# EAGLE design spt_interface_v5_withbattcheck (EAGLE 7.5.0)
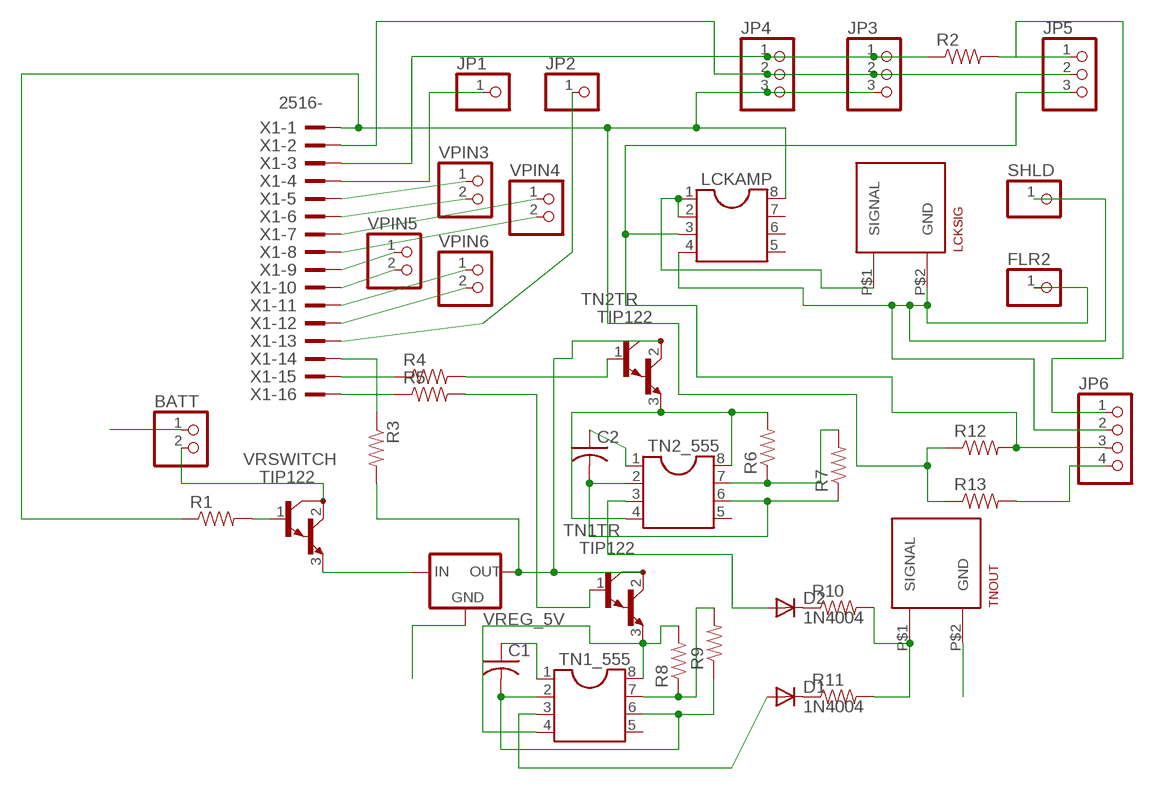
[diagram p0: schematic, sheet 1]

## Parts
BATT  PINHD-1X2  [1X02]
C1  C-US050-024X044  [C050-024X044]
C2  C-US050-024X044  [C050-024X044]
D1  1N4004  [DO41-10]
D2  1N4004  [DO41-10]
FLR2  PINHD-1X1  [1X01]
JP1  PINHD-1X1  [1X01]
JP2  PINHD-1X1  [1X01]
JP3  PINHD-1X3  [1X03]
JP4  PINHD-1X3  [1X03]
JP5  PINHD-1X3  [1X03]
JP6  PINHD-1X4  [1X04]
LCKAMP  DIL8  [DIL08]
LCKSIG  BNC_VERTICAL  [BNC_VERTICAL]
R1  1KOHM-1/4W-5%(PTH)HORIZ-KIT  [AXIAL-0.3EZ]
R2  1KOHM-1/4W-5%(PTH)HORIZ-KIT  [AXIAL-0.3EZ]
R3  1KOHM-1/4W-5%(PTH)HORIZ-KIT  [AXIAL-0.3EZ]
R4  1KOHM-1/4W-5%(PTH)HORIZ-KIT  [AXIAL-0.3EZ]
R5  1KOHM-1/4W-5%(PTH)HORIZ-KIT  [AXIAL-0.3EZ]
R6  1KOHM-1/4W-5%(PTH)HORIZ-KIT  [AXIAL-0.3EZ]
R7  1KOHM-1/4W-5%(PTH)HORIZ-KIT  [AXIAL-0.3EZ]
R8  1KOHM-1/4W-5%(PTH)HORIZ-KIT  [AXIAL-0.3EZ]
R9  1KOHM-1/4W-5%(PTH)HORIZ-KIT  [AXIAL-0.3EZ]
R10  1KOHM-1/4W-5%(PTH)HORIZ-KIT  [AXIAL-0.3EZ]
R11  1KOHM-1/4W-5%(PTH)HORIZ-KIT  [AXIAL-0.3EZ]
R12  1KOHM-1/4W-5%(PTH)HORIZ-KIT  [AXIAL-0.3EZ]
R13  1KOHM-1/4W-5%(PTH)HORIZ-KIT  [AXIAL-0.3EZ]
SHLD  PINHD-1X1  [1X01]
TN1_555  DIL8  [DIL08]
TN1TR  TIP122  [TO220]
TN2_555  DIL8  [DIL08]
TN2TR  TIP122  [TO220]
TNOUT  BNC_VERTICAL  [BNC_VERTICAL]
VPIN3  PINHD-1X2  [1X02]
VPIN4  PINHD-1X2  [1X02]
VPIN5  PINHD-1X2  [1X02]
VPIN6  PINHD-1X2  [1X02]
VREG_5V  78XXL  [78XXL]
VRSWITCH  TIP122  [TO220]
X1  2516-  [PAK100/2500-16]

## Nets
GND: BATT.1 C1.1 C2.1 FLR2.1 JP3.2 JP4.2 JP5.2 JP6.2 LCKAMP.4 LCKSIG.P$2(GND) SHLD.1 TN1_555.1 TN2_555.1 TNOUT.P$2(GND) VREG_5V.GND X1.2
N$1: R3.P$1 X1.14
N$2: BATT.2 VRSWITCH.2(C)
N$3: R4.P$2 TN2TR.1(B)
N$4: R5.P$2 TN1TR.1(B)
N$5: R8.P$2 TN1_555.4 TN1_555.8 TN1TR.3(E)
N$6: D2.C R10.P$1
N$7: R4.P$1 X1.15
N$8: JP3.3 JP4.3 LCKAMP.8 R1.P$1 R12.P$1 R13.P$1 X1.1
N$9: D1.A TN1_555.3
N$10: LCKAMP.1 LCKAMP.2 LCKSIG.P$1(SIGNAL)
N$11: R6.P$1 R7.P$2 TN2_555.7
N$12: R8.P$1 R9.P$2 TN1_555.7
N$13: C2.2 R7.P$1 TN2_555.2 TN2_555.6
N$14: C1.2 R9.P$1 TN1_555.2 TN1_555.6
N$15: D2.A TN2_555.3
N$16: VPIN5.1 X1.9
N$17: R10.P$2 R11.P$2 TNOUT.P$1(SIGNAL)
N$18: JP3.1 JP4.1 R2.P$1 X1.3
N$19: JP5.1 JP6.1 R2.P$2
N$20: VPIN3.1 X1.5
N$21: VPIN3.2 X1.6
N$22: VPIN4.1 X1.7
N$23: VPIN4.2 X1.8
N$24: VPIN5.2 X1.10
N$25: VPIN6.1 X1.11
N$26: VPIN6.2 X1.12
N$27: R6.P$2 TN2_555.4 TN2_555.8 TN2TR.3(E)
N$28: JP5.3 JP6.3 LCKAMP.3 R12.P$2
N$29: VREG_5V.IN VRSWITCH.3(E)
N$30: JP1.1 X1.4
N$31: JP2.1 X1.13
N$32: R1.P$2 VRSWITCH.1(B)
N$33: D1.C R11.P$1
N$34: R5.P$1 X1.16
N$35: R3.P$2 TN1TR.2(C) TN2TR.2(C) VREG_5V.OUT
N$36: JP6.4 R13.P$2
Unconnected: LCKAMP.5 LCKAMP.6 LCKAMP.7 TN1_555.5 TN2_555.5

## Library data of the parts
BATT VPIN3-VPIN6 = pinhead:PINHD-1X2: PIN HEADER
C1 C2 = rcl:C-US: CAPACITOR, American symbol
D1 D2 = diode:1N4004: DIODE general purpose rectifier, 1 A
FLR2 JP1 JP2 SHLD = pinhead:PINHD-1X1: PIN HEADER
JP3-JP5 = pinhead:PINHD-1X3: PIN HEADER
JP6 = pinhead:PINHD-1X4: PIN HEADER
LCKAMP TN1_555 TN2_555 = ic-package:DIL8: Dual In Line / Socket
LCKSIG TNOUT = open-ephys:BNC_VERTICAL: BNC plug, through-hole, vertical
R1-R13 = SparkFun-Resistors:1KOHM-1/4W-5%(PTH): RES-08380; PROD_ID: RES-08380; VALUE: 1k
TN1TR TN2TR VRSWITCH = transistor-npn:TIP122*: NPN Darlington Transistor
VREG_5V = v-reg:78XXL: VOLTAGE REGULATOR
X1 = con-3m:2516-: 3M (TM) Pak 100 4-Wall Header Source: 3M; OC_FARNELL: unknown; OC_NEWARK: unknown

## Board
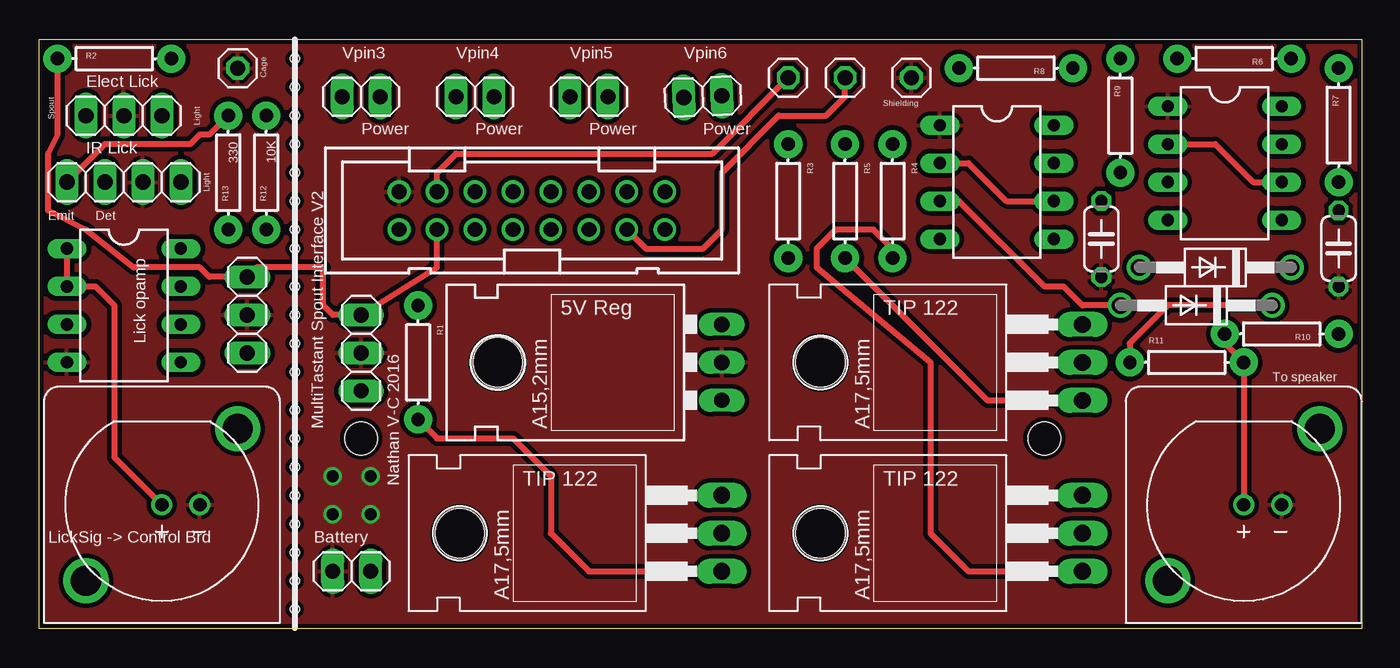
[diagram p1: board, top side]
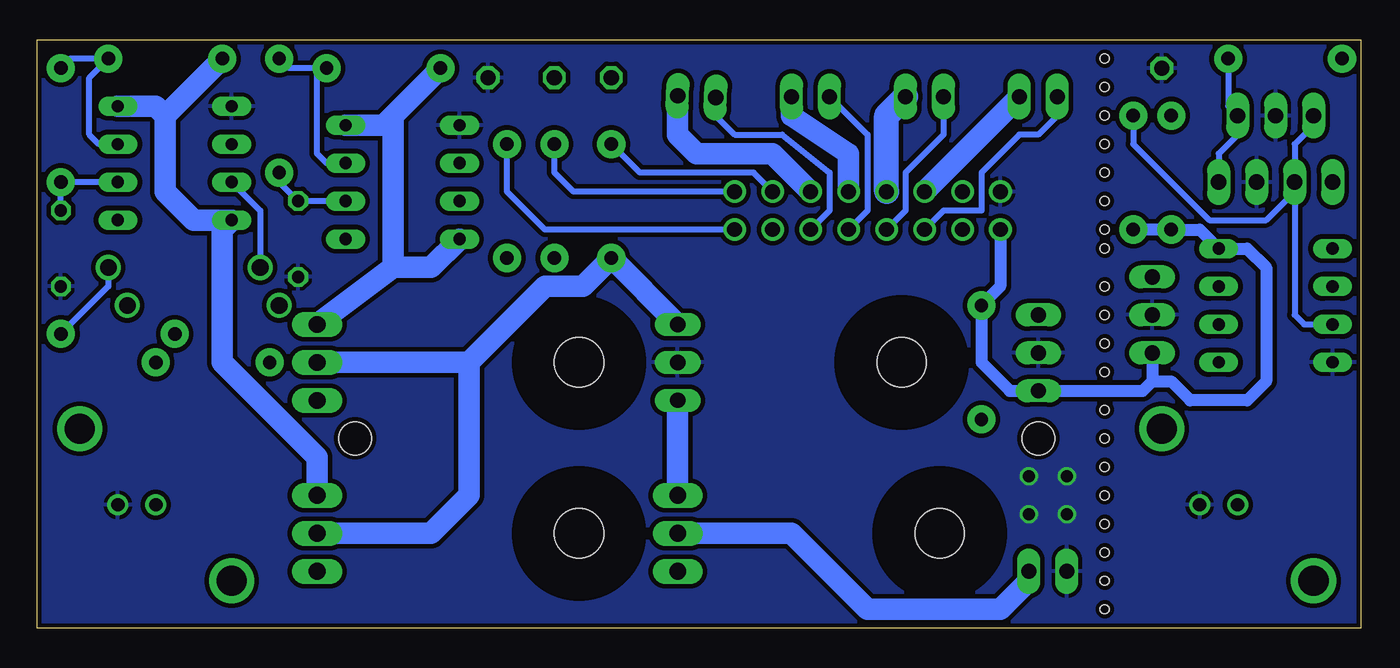
[diagram p2: board, bottom side, seen from below]

Size 88.57 x 39.36 mm. Coordinates in mm from the lower left corner, seen from the top.
Outline: 0,0 88.57,0 88.57,39.36 0,39.36 0,0
Copper layers (1*16): Top 0.035mm / dielectric 1.5mm / Bottom 0.035mm
Design rules "SeeedStudio_2layer_DRU_no_angle_20140221": minimum track width 6mil, minimum drill 12mil, track to track 6mil, track to pad 6mil, pad to pad 6mil, via to via 6mil, smd to smd 0mil, copper to edge 10mil, drill to drill 10mil, minimum pad ring 10mil, minimum via ring 6mil, stop-mask expansion 2mil, vias tented up to drill 100mil, thermal gap 10mil
Holes 2.2 mm at 21.59,12.7 67.31,12.7
Holes 0.6 mm at 17.14,38.1 17.14,36.2 17.14,34.29 17.14,32.38 17.14,28.57 17.14,26.67 17.14,25.4 17.14,22.86 17.14,20.95 17.14,19.05 17.14,17.14 17.14,14.61 17.14,30.48 17.14,12.7 17.14,10.79 17.14,8.89 17.14,6.99 17.14,5.08 17.14,3.17 17.14,1.27

### Footprints (pad centres in the part's own frame; a part is rotated, then mirrored left to right if it is on the bottom)
1X02 = drill 1.016 long: 1 -1.27,0; 2 1.27,0
C050-024X044 = drill 0.813 octagon: 1 -2.54,0; 2 2.54,0
DO41-10 = drill 1.118: A 5.08,0; C -5.08,0
1X01 = drill 1.016 octagon: 1 0,0
1X03 = drill 1.016 long: 1 -2.54,0; 2 0,0; 3 2.54,0
1X04 = drill 1.016 long: 1 -3.81,0; 2 -1.27,0; 3 1.27,0; 4 3.81,0
DIL08 = drill 0.813 long: 1 -3.81,-3.81; 2 -1.27,-3.81; 3 1.27,-3.81; 4 3.81,-3.81; 5 3.81,3.81; 6 1.27,3.81; 7 -1.27,3.81; 8 -3.81,3.81
BNC_VERTICAL = drill 0.89: P$1 0,0; P$2 2.54,0 | drill 2.01: P$3 5.08,5.08; P$4 -5.08,-5.08
AXIAL-0.3EZ = drill 0.9 pad 1.88: P$1 -3.81,0; P$2 3.81,0
TO220 = drill 1.118 long: 1 -2.54,-6.35; 2 0,-6.35; 3 2.54,-6.35 | hole 3.302: 0,11.176
78XXL = drill 1.016 long: GND 0,-3.81; IN -2.54,-3.81; OUT 2.54,-3.81 | hole 3.302: 0,11.176
PAK100/2500-16 = drill 1 pad 1.422: 1 -8.89,-1.27; 2 -8.89,1.27; 3 -6.35,-1.27; 4 -6.35,1.27; 5 -3.81,-1.27; 6 -3.81,1.27; 7 -1.27,-1.27; 8 -1.27,1.27; 9 1.27,-1.27; 10 1.27,1.27; 11 3.81,-1.27; 12 3.81,1.27; 13 6.35,-1.27; 14 6.35,1.27; 15 8.89,-1.27; 16 8.89,1.27

### Placement (x,y rotation side)
BATT  20.95,3.81 0 top
C1  71.12,26.04 90 top
C2  87,25.4 90 top
D1  77.47,21.59 180 top
D2  78.74,24.13 180 top
FLR2  13.34,37.47 0 top
JP1  50.16,36.83 0 top
JP2  53.98,36.83 0 top
JP3  13.97,20.95 270 top
JP4  21.59,18.41 270 top
JP5  5.71,34.29 180 top
JP6  5.71,29.84 180 top
LCKAMP  5.71,21.59 270 top
LCKSIG  8.26,8.26 0 top
R1  25.4,17.78 270 top
R2  5.08,38.1 0 top
R3  50.16,28.57 270 top
R4  57.15,28.57 270 top
R5  53.98,28.57 270 top
R6  80.01,38.1 180 top
R7  87,33.66 90 top
R8  65.41,37.47 180 top
R9  72.39,34.29 90 top
R10  83.19,19.68 180 top
R11  76.83,17.78 0 top
R12  15.24,30.48 90 top
R13  12.7,30.48 90 top
SHLD  58.42,36.83 0 top
TN1_555  64.14,29.84 270 top
TN1TR  63.5,17.78 90 top
TN2_555  79.38,31.11 270 top
TN2TR  63.5,6.35 90 top
TNOUT  80.64,8.26 0 top
VPIN3  21.59,35.56 0 top
VPIN4  29.21,35.56 0 top
VPIN5  36.83,35.56 0 top
VPIN6  44.45,35.56 2.5 top
VREG_5V  41.91,17.78 90 top
VRSWITCH  39.37,6.35 90 top
X1  33.02,27.94 0 top

### Tracks (layer width: path | path; a pad name or v marks a point on that pad's centre or on a via)
GND  (via drill 0.8)
  other vias: 19.68,10.16 22.23,10.16 22.23,7.62 19.68,7.62
  pour Bottom (isolate 0.305): 0,0 0,39.37 88.9,39.37 88.9,0
  pour Top (isolate 0.305): 0,0 0,39.37 88.9,39.37 88.9,0
N$1
  Bottom 0.406: X1.14 40.64,30.48 48.26,30.48 R3.P$1
N$2
  Bottom 1.422: BATT.2 22.23,3.17 24.13,1.27 33.02,1.27 38.1,6.35 VRSWITCH.2
N$3
  Top 0.406: R4.P$2 57.15,25.4 55.88,26.67 53.34,26.67 52.07,25.4 52.07,24.13 59.69,17.78 59.69,6.35 62.23,3.81 TN2TR.1
N$4
  Top 0.406: R5.P$2 63.5,15.24 TN1TR.1
N$5
  Bottom 1.422: TN1TR.3 64.77,24.13 | 64.77,24.13 64.77,34.29 | 64.77,34.29 R8.P$2 | TN1_555.8 65.41,33.66 64.77,34.29 | 64.77,24.13 62.23,24.13 TN1_555.4
N$6
  Bottom 0.406: D2.C 83.82,22.86 R10.P$1
N$7
  Bottom 0.406: X1.15 54.61,26.67 57.15,29.21 R4.P$1
N$8
  Bottom 0.813: X1.1 24.13,22.86 R1.P$1 25.4,17.78 23.5,15.88 JP4.3 14.61,15.88 13.97,16.51 | JP3.3 13.97,16.51 | R12.P$1 R13.P$1 10.79,26.67 LCKAMP.8 7.62,25.4 6.35,24.13 6.35,16.51 7.62,15.24 11.43,15.24 12.7,16.51 13.97,16.51
N$9
  Top 0.406: TN1_555.3 61.59,28.57 67.31,22.86 68.58,22.86 69.85,21.59 D1.A
N$10
  Top 0.406: LCKAMP.1 LCKAMP.2 3.81,22.86 5.08,21.59 5.08,11.43 LCKSIG.P$1
N$11
  Bottom 0.406: R7.P$2 86.36,38.1 R6.P$1 85.09,36.83 85.09,33.02 84.45,32.38 TN2_555.7
N$12
  Bottom 0.406: R8.P$1 69.85,37.47 | 69.85,37.47 71.75,37.47 R9.P$2 | TN1_555.7 69.22,31.11 69.85,31.75 69.85,37.47
N$13
  Top 0.406: TN2_555.2 78.74,32.38 81.28,29.84 TN2_555.6
  Bottom 0.406: TN2_555.6 R7.P$1 C2.2
N$14
  Top 0.406: TN1_555.2 62.23,31.11 64.77,28.57 TN1_555.6
  Bottom 0.406: R9.P$1 72.39,29.84 C1.2 TN1_555.6
N$15
  Bottom 0.406: TN2_555.3 73.66,27.94 D2.A
N$16
  Bottom 0.406: VPIN5.1 33.02,33.02 33.02,27.94 X1.9
N$17
  Top 0.406: R10.P$2 79.38,19.05 R11.P$2 TNOUT.P$1
N$18
  Top 0.406: X1.3 26.67,24.13 JP4.1 19.68,20.95 19.05,21.59 19.05,24.13 14.61,24.13 JP3.1 11.43,23.5 10.79,24.13 6.35,24.13 3.17,26.67 0.64,27.94 0.64,31.75 1.27,33.02 R2.P$1
N$19
  Bottom 0.406: R2.P$2 8.89,34.92 JP5.1 8.26,33.02 9.53,31.75 JP6.1
N$20
  Bottom 0.406: VPIN3.1 20.32,34.29 21.59,33.02 22.86,33.02 25.4,30.48 25.4,27.94 27.94,27.94 X1.5
N$21
  Bottom 1.422: X1.6 VPIN3.2
N$22
  Bottom 0.406: VPIN4.1 27.94,33.02 30.48,30.48 30.48,27.94 X1.7
N$23
  Bottom 1.676: X1.8 31.75,34.29 VPIN4.2
N$24
  Bottom 1.422: X1.10 34.29,31.75 38.1,34.29 VPIN5.2
N$25
  Bottom 0.406: VPIN6.1 43.18,34.29 41.91,33.02 38.73,33.02 35.56,30.48 35.56,27.94 X1.11
N$26
  Bottom 1.422: X1.12 39.37,31.75 44.45,31.75 45.72,33.02 VPIN6.2
N$27
  Bottom 1.422: TN2TR.3 69.85,11.43 76.2,17.78 76.2,26.67 TN2_555.4 78.11,27.3 80.01,29.21 80.01,34.29 | 80.01,34.29 R6.P$2 | TN2_555.8 80.64,34.92 80.01,34.29
N$28
  Bottom 0.406: JP5.3 3.17,33.66 4.45,32.38 JP6.3 4.45,29.21 | 4.45,29.21 4.45,20.95 3.81,20.32 LCKAMP.3 | R12.P$2 15.24,32.38 10.16,27.3 6.35,27.3 4.45,29.21
N$29
  Bottom 1.422: VRSWITCH.3 VREG_5V.IN
N$30
  Top 0.406: X1.4 26.67,30.48 27.94,31.75 45.09,31.75 JP1.1
N$31
  Top 0.406: X1.13 40.64,25.4 44.45,25.4 45.72,26.67 45.72,30.48 49.53,34.29 52.7,34.29 53.98,35.56 JP2.1
N$32
  Top 0.406: R1.P$2 26.67,12.7 31.75,12.7 34.29,10.16 34.29,6.35 36.83,3.81 VRSWITCH.1
N$33
  Top 0.406: D1.C 75.56,21.59 73.03,19.05 R11.P$1
N$34
  Bottom 0.406: X1.16 52.7,29.21 53.98,30.48 R5.P$1
N$35
  Bottom 1.422: VREG_5V.OUT R3.P$2 52.07,22.86 54.61,22.86 59.69,17.78 | 59.69,17.78 TN1TR.2 | TN2TR.2 62.23,6.35 59.69,8.89 59.69,17.78
N$36
  Top 0.406: R13.P$2 11.43,33.02 10.79,33.02 10.16,32.38 4.45,32.38 JP6.4

### Text on the board
tPlace: Vpin3 | Vpin4 | Vpin5 | Vpin6 | Cage | Spout | Shielding | Light | Power | Power | Power | Power | Light | Lick opamp | 5V Reg | TIP 122 | Nathan V-C 2016 | TIP 122 | TIP 122
tNames: Elect Lick | IR Lick | 330 | 10K | Emit | Det | To speaker | MultiTastant Spout Interface V2 | LickSig -> Control Brd | Battery